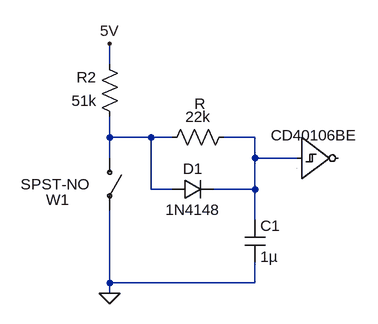
[diagram p0: schematic debouncing_button_circuit.asc]
debouncing_button_circuit.asc, the LTspice schematic file:
Version 4
SHEET 1 880 680
WIRE -352 -160 -352 -192
WIRE -352 -48 -352 -80
WIRE -288 -48 -352 -48
WIRE -256 -48 -288 -48
WIRE -128 -48 -176 -48
WIRE -352 -16 -352 -48
WIRE -128 -16 -128 -48
WIRE -64 -16 -128 -16
WIRE -288 32 -288 -48
WIRE -256 32 -288 32
WIRE -128 32 -128 -16
WIRE -128 32 -192 32
WIRE -128 80 -128 32
WIRE -352 176 -352 64
WIRE -128 176 -128 144
WIRE -128 176 -352 176
WIRE -352 192 -352 176
FLAG -352 -192 5V
FLAG -352 192 0
SYMBOL Digital\\schmtinv -64 -80 R0
WINDOW 0 -40 29 Left 2
SYMATTR InstName CD40106BE
SYMBOL diode -256 48 R270
WINDOW 0 32 32 VTop 2
WINDOW 3 0 32 VBottom 2
SYMATTR InstName D1
SYMATTR Value 1N4148
SYMBOL cap -144 80 R0
SYMATTR InstName C1
SYMATTR Value 1µ
SYMBOL res -160 -64 R90
WINDOW 0 0 56 VBottom 2
WINDOW 3 -51 53 VTop 2
SYMATTR InstName 22k
SYMBOL res -336 -64 R180
WINDOW 0 36 76 Left 2
WINDOW 3 36 40 Left 2
SYMATTR InstName R2
SYMATTR Value 51k
SYMBOL csw -352 -16 R0
WINDOW 0 -98 64 Left 2
WINDOW 3 -137 40 Left 2
SYMATTR InstName W1
SYMATTR Value SPST-NO

The netlist it stands for:
* debouncing_button_circuit.asc
A§CD40106BE N002 0 0 0 0 0 0 0 SCHMITT
D1 N001 N002 1N4148
C1 N002 0 1µ
R§22k N002 N001 R
R2 N001 5V 51k
W1 N001 0 SPST-NO
.model D D
.lib standard.dio
.backanno
.end